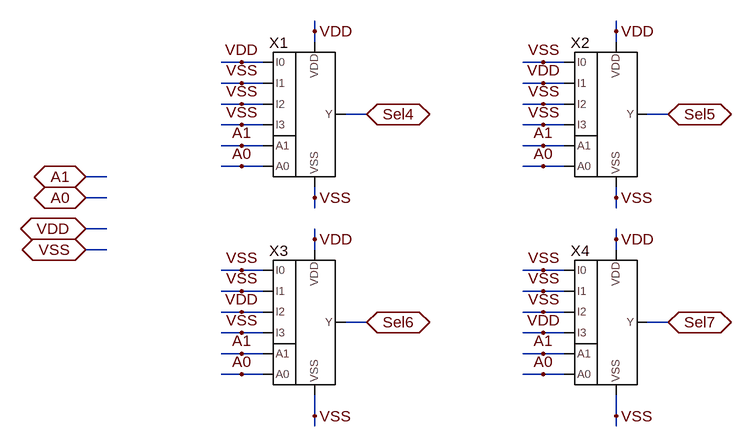
[diagram p0: schematic Sel_Cap.asc]
Sel_Cap.asc, the LTspice schematic file:
Version 4
SHEET 1 880 844
WIRE -48 192 -48 176
WIRE 416 192 416 176
WIRE -48 208 -48 192
WIRE 416 208 416 192
WIRE -160 240 -192 240
WIRE -128 240 -160 240
WIRE 304 240 272 240
WIRE 336 240 304 240
WIRE -160 272 -192 272
WIRE -128 272 -160 272
WIRE 304 272 272 272
WIRE 336 272 304 272
WIRE -160 304 -192 304
WIRE -128 304 -160 304
WIRE 304 304 272 304
WIRE 336 304 304 304
WIRE 32 320 0 320
WIRE 496 320 464 320
WIRE -160 336 -192 336
WIRE -128 336 -160 336
WIRE 304 336 272 336
WIRE 336 336 304 336
WIRE -160 368 -192 368
WIRE -128 368 -160 368
WIRE 304 368 272 368
WIRE 336 368 304 368
WIRE -160 400 -192 400
WIRE -128 400 -160 400
WIRE 304 400 272 400
WIRE 336 400 304 400
WIRE -368 416 -400 416
WIRE -368 448 -400 448
WIRE -48 448 -48 432
WIRE 416 448 416 432
WIRE -48 464 -48 448
WIRE 416 464 416 448
WIRE -368 496 -400 496
WIRE -48 512 -48 496
WIRE 416 512 416 496
WIRE -368 528 -400 528
WIRE -48 528 -48 512
WIRE 416 528 416 512
WIRE -160 560 -192 560
WIRE -128 560 -160 560
WIRE 304 560 272 560
WIRE 336 560 304 560
WIRE -160 592 -192 592
WIRE -128 592 -160 592
WIRE 304 592 272 592
WIRE 336 592 304 592
WIRE -160 624 -192 624
WIRE -128 624 -160 624
WIRE 304 624 272 624
WIRE 336 624 304 624
WIRE 32 640 0 640
WIRE 496 640 464 640
WIRE -160 656 -192 656
WIRE -128 656 -160 656
WIRE 304 656 272 656
WIRE 336 656 304 656
WIRE -160 688 -192 688
WIRE -128 688 -160 688
WIRE 304 688 272 688
WIRE 336 688 304 688
WIRE -160 720 -192 720
WIRE -128 720 -160 720
WIRE 304 720 272 720
WIRE 336 720 304 720
WIRE -48 784 -48 752
WIRE 416 784 416 752
WIRE -48 800 -48 784
WIRE 416 800 416 784
FLAG -400 416 A1
IOPIN -400 416 BiDir
FLAG -400 448 A0
IOPIN -400 448 BiDir
FLAG -160 368 A1
FLAG -160 400 A0
FLAG -160 336 VSS
FLAG -160 304 VSS
FLAG -160 272 VSS
FLAG -160 240 VDD
FLAG 32 320 Sel4
IOPIN 32 320 BiDir
FLAG 304 368 A1
FLAG 304 400 A0
FLAG 304 336 VSS
FLAG 304 304 VSS
FLAG 304 272 VDD
FLAG 304 240 VSS
FLAG 496 320 Sel5
IOPIN 496 320 BiDir
FLAG -160 688 A1
FLAG -160 720 A0
FLAG -160 656 VSS
FLAG -160 624 VDD
FLAG -160 592 VSS
FLAG -160 560 VSS
FLAG 32 640 Sel6
IOPIN 32 640 BiDir
FLAG 304 688 A1
FLAG 304 720 A0
FLAG 304 656 VDD
FLAG 304 624 VSS
FLAG 304 592 VSS
FLAG 304 560 VSS
FLAG 496 640 Sel7
IOPIN 496 640 BiDir
FLAG -400 496 VDD
IOPIN -400 496 BiDir
FLAG -400 528 VSS
IOPIN -400 528 BiDir
FLAG -48 192 VDD
FLAG 416 192 VDD
FLAG -48 512 VDD
FLAG 416 512 VDD
FLAG -48 448 VSS
FLAG 416 448 VSS
FLAG 416 784 VSS
FLAG -48 784 VSS
SYMBOL MUX41 -112 224 R0
WINDOW 0 -6 -14 Left 0
SYMATTR InstName X1
SYMBOL MUX41 352 224 R0
WINDOW 0 -6 -14 Left 0
SYMATTR InstName X2
SYMBOL MUX41 -112 544 R0
WINDOW 0 -6 -14 Left 0
SYMATTR InstName X3
SYMBOL MUX41 352 544 R0
WINDOW 0 -6 -14 Left 0
SYMATTR InstName X4

The netlist it stands for:
* Sel_Cap.asc
XX1 A1 A0 VDD VSS VSS VSS Sel4 VDD VSS MUX41  ; pins A1 A0 I0 I1 I2 I3 Y VDD VSS
XX2 A1 A0 VSS VDD VSS VSS Sel5 VDD VSS MUX41  ; pins A1 A0 I0 I1 I2 I3 Y VDD VSS
XX3 A1 A0 VSS VSS VDD VSS Sel6 VDD VSS MUX41  ; pins A1 A0 I0 I1 I2 I3 Y VDD VSS
XX4 A1 A0 VSS VSS VSS VDD Sel7 VDD VSS MUX41  ; pins A1 A0 I0 I1 I2 I3 Y VDD VSS
.backanno
.end